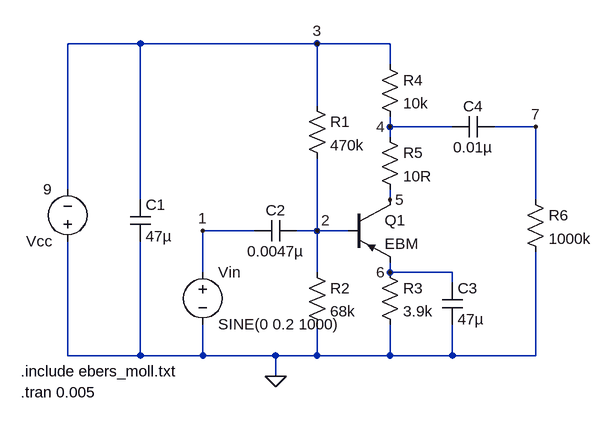
[diagram p0: schematic dallas_rangemaster.asc]
dallas_rangemaster.asc, the LTspice schematic file:
Version 4
SHEET 1 880 680
WIRE 112 -128 0 -128
WIRE 384 -128 112 -128
WIRE 496 -128 384 -128
WIRE 496 -96 496 -128
WIRE 384 -32 384 -128
WIRE 496 0 496 -16
WIRE 592 0 496 0
WIRE 720 0 656 0
WIRE 496 16 496 0
WIRE 0 96 0 -128
WIRE 112 112 112 -128
WIRE 496 112 496 96
WIRE 720 112 720 0
WIRE 288 160 208 160
WIRE 384 160 384 48
WIRE 384 160 352 160
WIRE 432 160 384 160
WIRE 208 224 208 160
WIRE 384 224 384 160
WIRE 496 224 496 208
WIRE 592 224 496 224
WIRE 592 240 592 224
WIRE 0 352 0 176
WIRE 112 352 112 176
WIRE 112 352 0 352
WIRE 208 352 208 304
WIRE 208 352 112 352
WIRE 320 352 208 352
WIRE 384 352 384 304
WIRE 384 352 320 352
WIRE 496 352 496 304
WIRE 496 352 384 352
WIRE 592 352 592 304
WIRE 592 352 496 352
WIRE 720 352 720 192
WIRE 720 352 592 352
WIRE 320 384 320 352
FLAG 320 384 0
FLAG 208 160 1
FLAG 384 160 2
FLAG 384 -128 3
FLAG 496 0 4
FLAG 496 112 5
FLAG 496 224 6
FLAG 720 0 7
SYMBOL voltage 0 192 R180
WINDOW 123 0 0 Left 2
WINDOW 39 0 0 Left 2
SYMATTR InstName Vcc
SYMATTR Value 9
SYMBOL voltage 208 208 R0
WINDOW 123 24 124 Left 2
WINDOW 39 0 0 Left 2
SYMATTR InstName Vin
SYMATTR Value SINE(0 0.2 1000)
SYMBOL cap 96 112 R0
SYMATTR InstName C1
SYMATTR Value 47µ
SYMBOL cap 352 144 R90
WINDOW 0 0 32 VBottom 2
WINDOW 3 32 32 VTop 2
SYMATTR InstName C2
SYMATTR Value 0.0047µ
SYMBOL res 368 208 R0
SYMATTR InstName R2
SYMATTR Value 68k
SYMBOL res 368 -48 R0
SYMATTR InstName R1
SYMATTR Value 470k
SYMBOL res 480 208 R0
SYMATTR InstName R3
SYMATTR Value 3.9k
SYMBOL cap 576 240 R0
SYMATTR InstName C3
SYMATTR Value 47µ
SYMBOL res 480 0 R0
SYMATTR InstName R5
SYMATTR Value 10R
SYMBOL res 480 -112 R0
SYMATTR InstName R4
SYMATTR Value 10k
SYMBOL cap 656 -16 R90
WINDOW 0 0 32 VBottom 2
WINDOW 3 32 32 VTop 2
SYMATTR InstName C4
SYMATTR Value 0.01µ
SYMBOL res 704 96 R0
SYMATTR InstName R6
SYMATTR Value 1000k
SYMBOL pnp 432 112 R0
SYMATTR InstName Q1
SYMATTR Value EBM
SYMATTR Prefix Q
TEXT -72 408 Left 2 !.tran 0.005
TEXT -72 376 Left 2 !.include ebers_moll.txt

The netlist it stands for:
* dallas_rangemaster.asc
Vcc 0 3 9
Vin 1 0 SINE(0 0.2 1000)
C1 3 0 47µ
C2 2 1 0.0047µ
R2 2 0 68k
R1 3 2 470k
R3 6 0 3.9k
C3 6 0 47µ
R5 4 5 10R
R4 3 4 10k
C4 7 4 0.01µ
R6 7 0 1000k
Q1 5 2 6 0 EBM
.model NPN NPN
.model PNP PNP
.lib standard.bjt
.tran 0.005
.include ebers_moll.txt
.backanno
.end